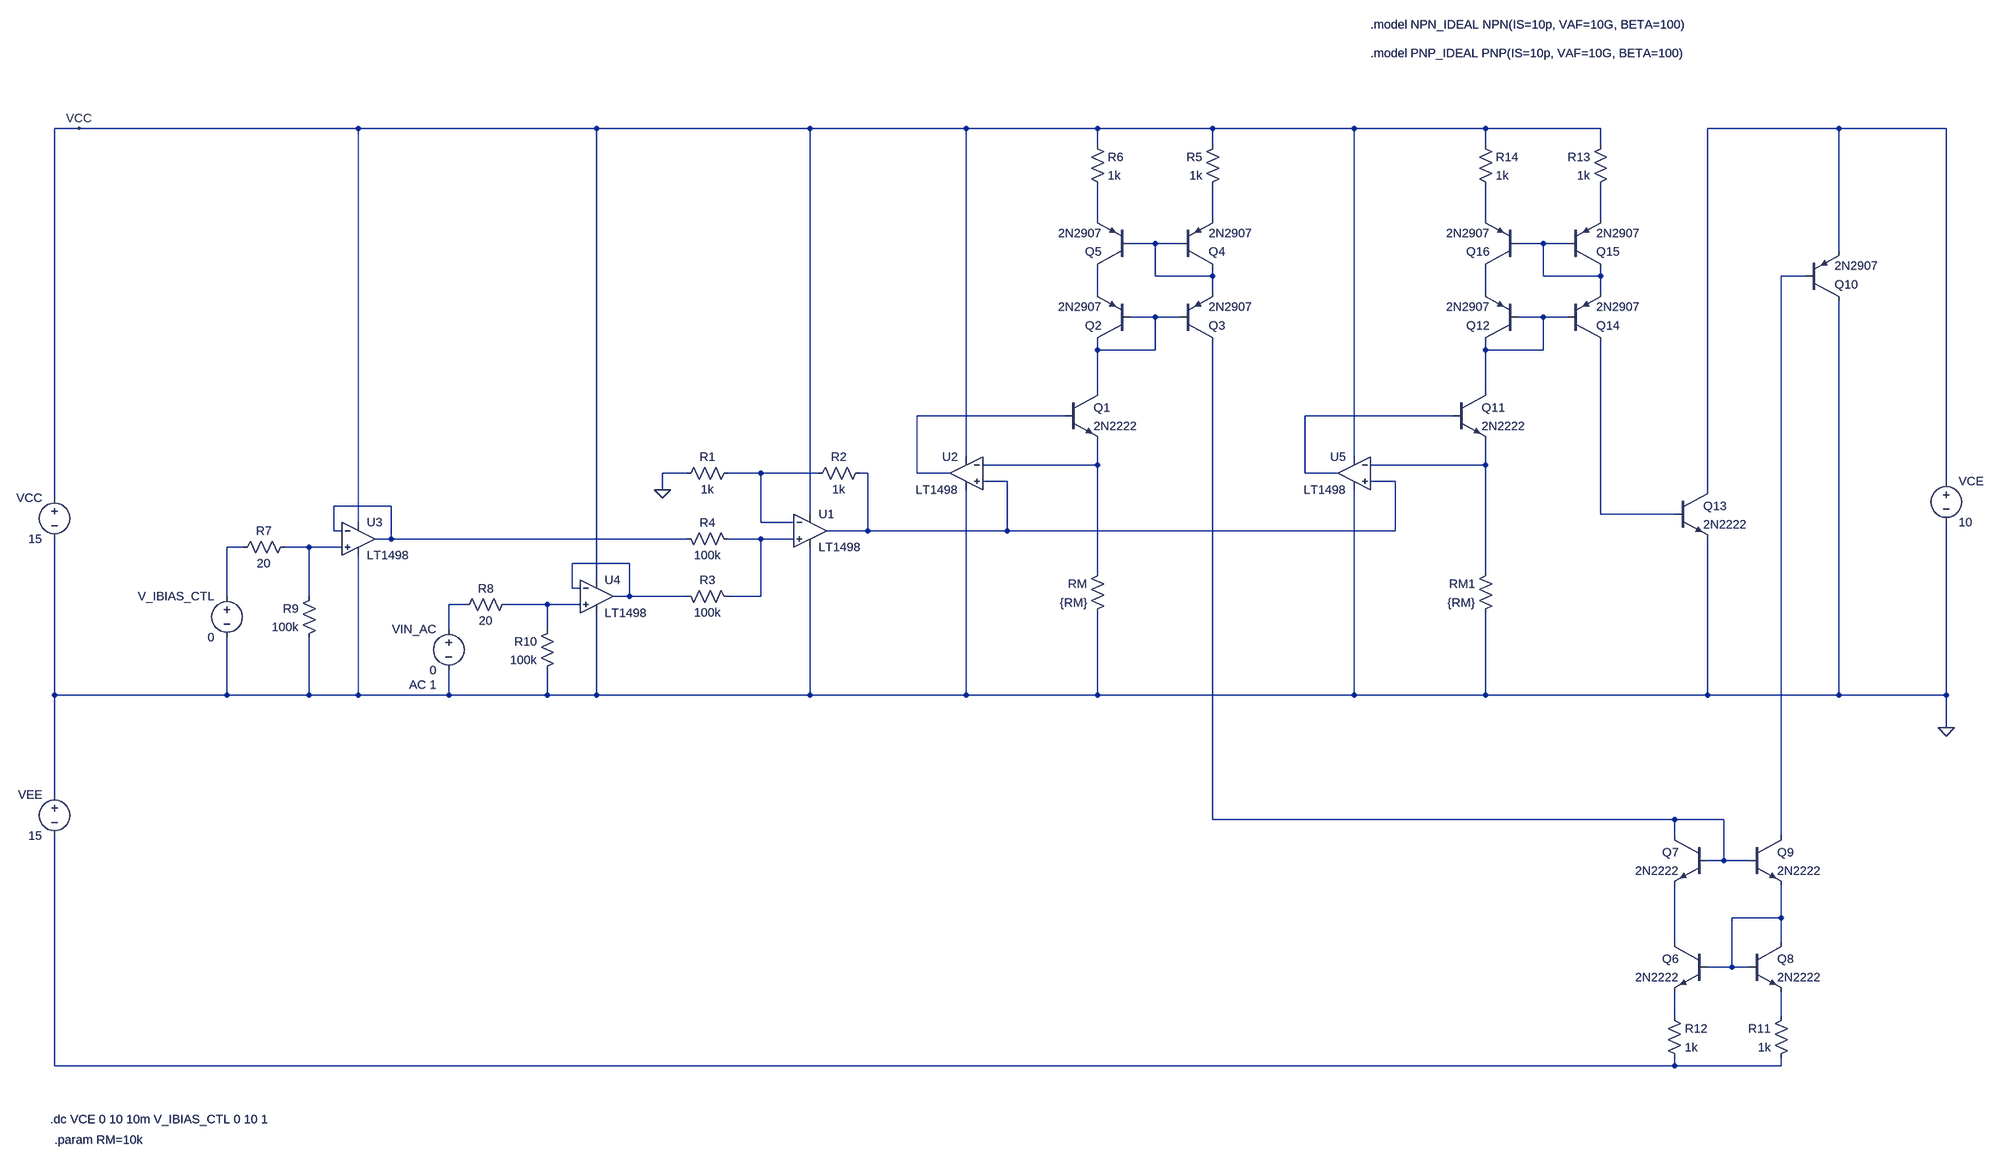
[diagram p0: schematic Curve_Tracer_IB_Generator.asc]
Curve_Tracer_IB_Generator.asc, the LTspice schematic file:
Version 4.1
SHEET 1 1784 1536
WIRE -2432 -544 -2480 -544
WIRE -1888 -544 -2432 -544
WIRE -1424 -544 -1888 -544
WIRE -1008 -544 -1424 -544
WIRE -704 -544 -1008 -544
WIRE -448 -544 -704 -544
WIRE -224 -544 -448 -544
WIRE 80 -544 -224 -544
WIRE 336 -544 80 -544
WIRE 560 -544 336 -544
WIRE 1024 -544 768 -544
WIRE 1280 -544 1024 -544
WIRE -448 -512 -448 -544
WIRE -224 -512 -224 -544
WIRE 336 -512 336 -544
WIRE 560 -512 560 -544
WIRE -448 -368 -448 -432
WIRE -224 -368 -224 -432
WIRE 336 -368 336 -432
WIRE 560 -368 560 -432
WIRE -336 -320 -384 -320
WIRE -288 -320 -336 -320
WIRE 448 -320 400 -320
WIRE 496 -320 448 -320
WIRE 1024 -304 1024 -544
WIRE -336 -256 -336 -320
WIRE -224 -256 -224 -272
WIRE -224 -256 -336 -256
WIRE 448 -256 448 -320
WIRE 560 -256 560 -272
WIRE 560 -256 448 -256
WIRE 960 -256 912 -256
WIRE -448 -224 -448 -272
WIRE -224 -224 -224 -256
WIRE 336 -224 336 -272
WIRE 560 -224 560 -256
WIRE -336 -176 -384 -176
WIRE -288 -176 -336 -176
WIRE 448 -176 400 -176
WIRE 496 -176 448 -176
WIRE -448 -112 -448 -128
WIRE -336 -112 -336 -176
WIRE -336 -112 -448 -112
WIRE 336 -112 336 -128
WIRE 448 -112 448 -176
WIRE 448 -112 336 -112
WIRE -448 -32 -448 -112
WIRE 336 -32 336 -112
WIRE -512 16 -800 16
WIRE 272 16 -16 16
WIRE -704 96 -704 -544
WIRE 80 96 80 -544
WIRE -448 112 -448 64
WIRE -448 112 -672 112
WIRE 336 112 336 64
WIRE 336 112 112 112
WIRE -1248 128 -1296 128
WIRE -1104 128 -1168 128
WIRE -992 128 -1104 128
WIRE -896 128 -912 128
WIRE -800 128 -800 16
WIRE -736 128 -800 128
WIRE -16 128 -16 16
WIRE 48 128 -16 128
WIRE -624 144 -672 144
WIRE 160 144 112 144
WIRE 1280 144 1280 -544
WIRE -1296 160 -1296 128
WIRE 768 160 768 -544
WIRE -2480 176 -2480 -544
WIRE -1824 192 -1936 192
WIRE -1008 208 -1008 -544
WIRE 560 208 560 -128
WIRE 704 208 560 208
WIRE -1888 224 -1888 -544
WIRE -1104 224 -1104 128
WIRE -1040 224 -1104 224
WIRE -1936 240 -1936 192
WIRE -1920 240 -1936 240
WIRE -896 240 -896 128
WIRE -896 240 -976 240
WIRE -624 240 -624 144
WIRE -624 240 -896 240
WIRE 160 240 160 144
WIRE 160 240 -624 240
WIRE -1824 256 -1824 192
WIRE -1824 256 -1856 256
WIRE -1248 256 -1824 256
WIRE -1104 256 -1168 256
WIRE -1040 256 -1104 256
WIRE -2112 272 -2144 272
WIRE -1984 272 -2032 272
WIRE -1920 272 -1984 272
WIRE -1360 304 -1472 304
WIRE -448 320 -448 112
WIRE 336 320 336 112
WIRE -1424 336 -1424 -544
WIRE -1472 352 -1472 304
WIRE -1456 352 -1472 352
WIRE -2144 368 -2144 272
WIRE -1984 368 -1984 272
WIRE -1360 368 -1360 304
WIRE -1360 368 -1392 368
WIRE -1248 368 -1360 368
WIRE -1104 368 -1104 256
WIRE -1104 368 -1168 368
WIRE -1680 384 -1712 384
WIRE -1520 384 -1600 384
WIRE -1456 384 -1520 384
WIRE -1712 432 -1712 384
WIRE -1520 432 -1520 384
WIRE -2480 560 -2480 256
WIRE -2144 560 -2144 448
WIRE -2144 560 -2480 560
WIRE -1984 560 -1984 448
WIRE -1984 560 -2144 560
WIRE -1888 560 -1888 288
WIRE -1888 560 -1984 560
WIRE -1712 560 -1712 512
WIRE -1712 560 -1888 560
WIRE -1520 560 -1520 512
WIRE -1520 560 -1712 560
WIRE -1424 560 -1424 400
WIRE -1424 560 -1520 560
WIRE -1008 560 -1008 272
WIRE -1008 560 -1424 560
WIRE -704 560 -704 160
WIRE -704 560 -1008 560
WIRE -448 560 -448 400
WIRE -448 560 -704 560
WIRE 80 560 80 160
WIRE 80 560 -448 560
WIRE 336 560 336 400
WIRE 336 560 80 560
WIRE 768 560 768 256
WIRE 768 560 336 560
WIRE 1024 560 1024 -208
WIRE 1024 560 768 560
WIRE 1280 560 1280 224
WIRE 1280 560 1024 560
WIRE 1280 624 1280 560
WIRE -2480 848 -2480 560
WIRE -224 896 -224 -128
WIRE 704 896 -224 896
WIRE 800 896 704 896
WIRE 704 928 704 896
WIRE 912 928 912 -256
WIRE 800 976 800 896
WIRE 800 976 768 976
WIRE 848 976 800 976
WIRE 912 1088 912 1024
WIRE 912 1088 816 1088
WIRE 704 1136 704 1024
WIRE 912 1136 912 1088
WIRE 816 1184 816 1088
WIRE 816 1184 768 1184
WIRE 848 1184 816 1184
WIRE 704 1280 704 1232
WIRE 912 1280 912 1232
WIRE -2480 1376 -2480 928
WIRE 704 1376 704 1360
WIRE 704 1376 -2480 1376
WIRE 912 1376 912 1360
WIRE 912 1376 704 1376
FLAG 1280 624 0
FLAG -1296 160 0
FLAG -2432 -544 VCC
SYMBOL voltage 1280 128 R0
WINDOW 123 0 0 Left 0
WINDOW 39 0 0 Left 0
SYMATTR InstName VCE
SYMATTR Value 10
SYMBOL npn -512 -32 R0
SYMATTR InstName Q1
SYMATTR Value 2N2222
SYMBOL voltage -2480 160 M0
WINDOW 123 0 0 Left 0
WINDOW 39 0 0 Left 0
SYMATTR InstName VCC
SYMATTR Value 15
SYMBOL OpAmps\\LT1498 -1008 176 R0
SYMATTR InstName U1
SYMBOL voltage -2144 352 M0
WINDOW 123 0 0 Left 0
WINDOW 39 0 0 Left 0
SYMATTR InstName V_IBIAS_CTL
SYMATTR Value 0
SYMBOL res -432 304 M0
SYMATTR InstName RM
SYMATTR Value {RM}
SYMBOL OpAmps\\LT1498 -704 64 M0
SYMATTR InstName U2
SYMBOL res -1264 144 R270
WINDOW 0 32 56 VTop 2
WINDOW 3 0 56 VBottom 2
SYMATTR InstName R1
SYMATTR Value 1k
SYMBOL voltage -1712 416 M0
WINDOW 123 24 124 Left 2
WINDOW 39 0 0 Left 0
SYMATTR Value2 AC 1
SYMATTR InstName VIN_AC
SYMATTR Value 0
SYMBOL res -1008 144 R270
WINDOW 0 32 56 VTop 2
WINDOW 3 0 56 VBottom 2
SYMATTR InstName R2
SYMATTR Value 1k
SYMBOL res -1152 384 M270
WINDOW 0 32 56 VTop 2
WINDOW 3 0 56 VBottom 2
SYMATTR InstName R3
SYMATTR Value 100k
SYMBOL pnp -384 -128 R180
SYMATTR InstName Q2
SYMATTR Value 2N2907
SYMBOL pnp -288 -128 M180
SYMATTR InstName Q3
SYMATTR Value 2N2907
SYMBOL pnp -288 -272 M180
SYMATTR InstName Q4
SYMATTR Value 2N2907
SYMBOL pnp -384 -272 R180
SYMATTR InstName Q5
SYMATTR Value 2N2907
SYMBOL res -208 -528 M0
SYMATTR InstName R5
SYMATTR Value 1k
SYMBOL res -464 -528 R0
SYMATTR InstName R6
SYMATTR Value 1k
SYMBOL res -1152 272 M270
WINDOW 0 32 56 VTop 2
WINDOW 3 0 56 VBottom 2
SYMATTR InstName R4
SYMATTR Value 100k
SYMBOL OpAmps\\LT1498 -1888 192 R0
SYMATTR InstName U3
SYMBOL OpAmps\\LT1498 -1424 304 R0
SYMATTR InstName U4
SYMBOL res -2128 288 R270
WINDOW 0 32 56 VTop 2
WINDOW 3 0 56 VBottom 2
SYMATTR InstName R7
SYMATTR Value 20
SYMBOL res -1696 400 R270
WINDOW 0 32 56 VTop 2
WINDOW 3 0 56 VBottom 2
SYMATTR InstName R8
SYMATTR Value 20
SYMBOL res -1968 352 M0
SYMATTR InstName R9
SYMATTR Value 100k
SYMBOL res -1504 416 M0
SYMATTR InstName R10
SYMATTR Value 100k
SYMBOL npn 768 1136 M0
SYMATTR InstName Q6
SYMATTR Value 2N2222
SYMBOL npn 768 928 M0
SYMATTR InstName Q7
SYMATTR Value 2N2222
SYMBOL npn 848 1136 R0
SYMATTR InstName Q8
SYMATTR Value 2N2222
SYMBOL npn 848 928 R0
SYMATTR InstName Q9
SYMATTR Value 2N2222
SYMBOL res 928 1264 M0
SYMATTR InstName R11
SYMATTR Value 1k
SYMBOL res 688 1264 R0
SYMATTR InstName R12
SYMATTR Value 1k
SYMBOL pnp 960 -208 M180
SYMATTR InstName Q10
SYMATTR Value 2N2907
SYMBOL voltage -2480 832 M0
WINDOW 123 0 0 Left 0
WINDOW 39 0 0 Left 0
SYMATTR InstName VEE
SYMATTR Value 15
SYMBOL npn 704 160 R0
SYMATTR InstName Q13
SYMATTR Value 2N2222
SYMBOL npn 272 -32 R0
SYMATTR InstName Q11
SYMATTR Value 2N2222
SYMBOL res 352 304 M0
SYMATTR InstName RM1
SYMATTR Value {RM}
SYMBOL OpAmps\\LT1498 80 64 M0
SYMATTR InstName U5
SYMBOL pnp 400 -128 R180
SYMATTR InstName Q12
SYMATTR Value 2N2907
SYMBOL pnp 496 -128 M180
SYMATTR InstName Q14
SYMATTR Value 2N2907
SYMBOL pnp 496 -272 M180
SYMATTR InstName Q15
SYMATTR Value 2N2907
SYMBOL pnp 400 -272 R180
SYMATTR InstName Q16
SYMATTR Value 2N2907
SYMBOL res 576 -528 M0
SYMATTR InstName R13
SYMATTR Value 1k
SYMBOL res 320 -528 R0
SYMATTR InstName R14
SYMATTR Value 1k
TEXT -2488 1480 Left 2 !.dc VCE 0 10 10m V_IBIAS_CTL 0 10 1
TEXT -2480 1520 Left 2 !.param RM=10k
TEXT 112 -824 Left 2 !.model PNP_IDEAL PNP(IS=10p, VAF=10G, BETA=100)
TEXT 112 -880 Left 2 !.model NPN_IDEAL NPN(IS=10p, VAF=10G, BETA=100)

The netlist it stands for:
* Curve_Tracer_IB_Generator.asc
VCE N001 0 10
Q1 N011 N013 N015 0 2N2222
VCC VCC 0 15
X§U1 N021 N017 VCC 0 N018 LT1498  ; pins In+ In- V+ V- OUT
V_IBIAS_CTL N022 0 0
RM N015 0 {RM}
X§U2 N018 N015 VCC 0 N013 LT1498  ; pins In+ In- V+ V- OUT
R1 0 N017 1k
VIN_AC N025 0 0 AC 1
R2 N017 N018 1k
R3 N021 N024 100k
Q2 N011 N011 N009 0 2N2907
Q3 N027 N011 N006 0 2N2907
Q4 N006 N006 N003 0 2N2907
Q5 N009 N006 N002 0 2N2907
R5 VCC N003 1k
R6 VCC N002 1k
R4 N021 N019 100k
X§U3 N023 N019 VCC 0 N019 LT1498  ; pins In+ In- V+ V- OUT
X§U4 N026 N024 VCC 0 N024 LT1498  ; pins In+ In- V+ V- OUT
R7 N022 N023 20
R8 N025 N026 20
R9 N023 0 100k
R10 N026 0 100k
Q6 N029 N028 N030 0 2N2222
Q7 N027 N027 N029 0 2N2222
Q8 N028 N028 N031 0 2N2222
Q9 N008 N027 N028 0 2N2222
R11 N031 N032 1k
R12 N030 N032 1k
Q10 0 N008 N001 0 2N2907
VEE 0 N032 15
Q13 N001 N020 0 0 2N2222
Q11 N012 N014 N016 0 2N2222
RM1 N016 0 {RM}
X§U5 N018 N016 VCC 0 N014 LT1498  ; pins In+ In- V+ V- OUT
Q12 N012 N012 N010 0 2N2907
Q14 N020 N012 N007 0 2N2907
Q15 N007 N007 N005 0 2N2907
Q16 N010 N007 N004 0 2N2907
R13 VCC N005 1k
R14 VCC N004 1k
.model NPN NPN
.model PNP PNP
.lib standard.bjt
.dc VCE 0 10 10m V_IBIAS_CTL 0 10 1
.param RM=10k
.model PNP_IDEAL PNP(IS=10p, VAF=10G, BETA=100)
.model NPN_IDEAL NPN(IS=10p, VAF=10G, BETA=100)
.lib LTC.lib
.backanno
.end